# EAGLE design failoverBoard (EAGLE 7.7.0)
Failover Board: Allows an RC controller (like a DragonLink) to manually take over up to 7 PWM connections.

## Sheet 1 of 2
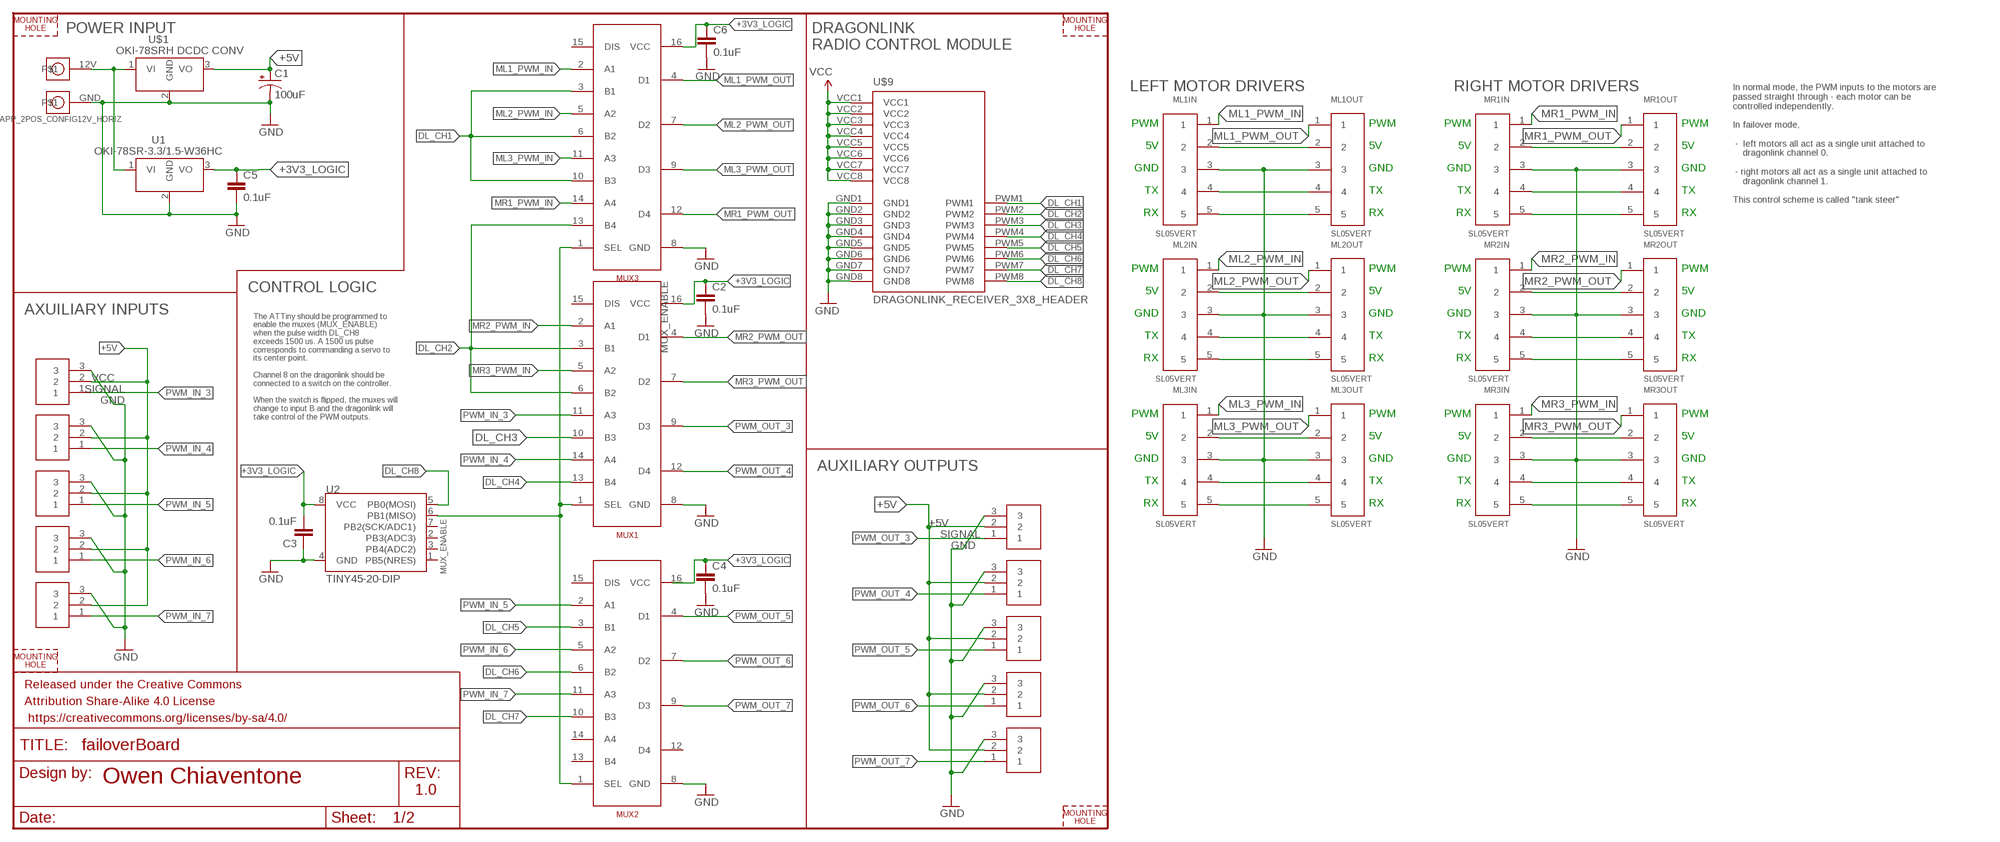
[diagram p0: schematic, sheet 1]

### Parts
C1  100uF  C_UHE1H121MPD1TD  [C_3.5MM]
C2  0.1uF  BOOST_CMP_CAP0603-CAP  [BOOST_CMP_0603-CAP]
C3  0.1uF  BOOST_CMP_CAP0603-CAP  [BOOST_CMP_0603-CAP]
C4  0.1uF  BOOST_CMP_CAP0603-CAP  [BOOST_CMP_0603-CAP]
C5  0.1uF  CAP0603-CAP  [0603-CAP]
C6  0.1uF  BOOST_CMP_CAP0603-CAP  [BOOST_CMP_0603-CAP]
FRAME1  FRAME-LETTER  [CREATIVE_COMMONS]
IN3  SIERRAALTO.CONN.SUPPLEMENT_CONN_3MOLEX_0705550037  [SIERRAALTO.CONN.SUPPLEMENT_MOLEX_0705550037_3]
IN4  SIERRAALTO.CONN.SUPPLEMENT_CONN_3MOLEX_0705550037  [SIERRAALTO.CONN.SUPPLEMENT_MOLEX_0705550037_3]
IN5  SIERRAALTO.CONN.SUPPLEMENT_CONN_3MOLEX_0705550037  [SIERRAALTO.CONN.SUPPLEMENT_MOLEX_0705550037_3]
IN6  SIERRAALTO.CONN.SUPPLEMENT_CONN_3MOLEX_0705550037  [SIERRAALTO.CONN.SUPPLEMENT_MOLEX_0705550037_3]
IN7  SIERRAALTO.CONN.SUPPLEMENT_CONN_3MOLEX_0705550037  [SIERRAALTO.CONN.SUPPLEMENT_MOLEX_0705550037_3]
J1  APP_2POS_CONFIG12V_HORIZ  [APP45_12V_HORIZ_CONFIG]
ML1IN  SL05VERT  [MOLEX-70543-0004]
ML1OUT  SL05VERT  [MOLEX-70543-0004]
ML2IN  SL05VERT  [MOLEX-70543-0004]
ML2OUT  SL05VERT  [MOLEX-70543-0004]
ML3IN  SL05VERT  [MOLEX-70543-0004]
ML3OUT  SL05VERT  [MOLEX-70543-0004]
MR1IN  SL05VERT  [MOLEX-70543-0004]
MR1OUT  SL05VERT  [MOLEX-70543-0004]
MR2IN  SL05VERT  [MOLEX-70543-0004]
MR2OUT  SL05VERT  [MOLEX-70543-0004]
MR3IN  SL05VERT  [MOLEX-70543-0004]
MR3OUT  SL05VERT  [MOLEX-70543-0004]
MUX1  CD40257  [SOIC16]
MUX2  CD40257  [SOIC16]
MUX3  CD40257  [SOIC16]
OUT3  SIERRAALTO.CONN.SUPPLEMENT_CONN_3MOLEX_0705550037  [SIERRAALTO.CONN.SUPPLEMENT_MOLEX_0705550037_3]
OUT4  SIERRAALTO.CONN.SUPPLEMENT_CONN_3MOLEX_0705550037  [SIERRAALTO.CONN.SUPPLEMENT_MOLEX_0705550037_3]
OUT5  SIERRAALTO.CONN.SUPPLEMENT_CONN_3MOLEX_0705550037  [SIERRAALTO.CONN.SUPPLEMENT_MOLEX_0705550037_3]
OUT6  SIERRAALTO.CONN.SUPPLEMENT_CONN_3MOLEX_0705550037  [SIERRAALTO.CONN.SUPPLEMENT_MOLEX_0705550037_3]
OUT7  SIERRAALTO.CONN.SUPPLEMENT_CONN_3MOLEX_0705550037  [SIERRAALTO.CONN.SUPPLEMENT_MOLEX_0705550037_3]
U1  OKI-78SR-3.3/1.5-W36HC  [OKI-78SR_HORIZ]
U2  TINY45-20-DIP  ATTINY45TINY45-20-DIP  [DIP08]
U$1  Q_OKI-78SR  [OKI-78SR_HORIZ]
U$3  MOUNTING_HOLE#6  [#6_SCREW]
U$4  MOUNTING_HOLE#6  [#6_SCREW]
U$5  MOUNTING_HOLE#6  [#6_SCREW]
U$6  MOUNTING_HOLE#6  [#6_SCREW]
U$9  DRAGONLINK_RECEIVER_3X8_HEADER  [3X8_HEADER_2.54MM]

### Nets
+3V3_LOGIC: C2.1 C3.2 C4.1 C5.1 C6.1 MUX1.16(VCC) MUX2.16(VCC) MUX3.16(VCC) U1.3(VO) U2.8(VCC)
+5V: C1.+ IN3.2 IN4.2 IN5.2 IN6.2 IN7.2 OUT3.2 OUT4.2 OUT5.2 OUT6.2 OUT7.2 U$1.3(VO)
DL_CH1: MUX3.3(B1) MUX3.6(B2) MUX3.10(B3) U$9.PWM1
DL_CH2: MUX1.3(B1) MUX1.6(B2) MUX3.13(B4) U$9.PWM2
DL_CH3: MUX1.10(B3) U$9.PWM3
DL_CH4: MUX1.13(B4) U$9.PWM4
DL_CH5: MUX2.3(B1) U$9.PWM5
DL_CH6: MUX2.6(B2) U$9.PWM6
DL_CH7: MUX2.10(B3) U$9.PWM7
DL_CH8: U2.5(PB0(MOSI)) U$9.PWM8
GND: C1.- C2.2 C3.1 C4.2 C5.2 C6.2 IN3.3 IN4.3 IN5.3 IN6.3 IN7.3 J1.GND ML1IN.3 ML1OUT.3 ML2IN.3 ML2OUT.3 ML3IN.3 ML3OUT.3 MR1IN.3 MR1OUT.3 MR2IN.3 MR2OUT.3 MR3IN.3 MR3OUT.3 MUX1.8(GND) MUX2.8(GND) MUX3.8(GND) OUT3.3 OUT4.3 OUT5.3 OUT6.3 OUT7.3 U1.2(GND) U2.4(GND) U$1.2(GND) U$9.GND1 U$9.GND2 U$9.GND3 U$9.GND4 U$9.GND5 U$9.GND6 U$9.GND7 U$9.GND8
ML1_PWM_IN: ML1IN.1 MUX3.2(A1)
ML1_PWM_OUT: ML1OUT.1 MUX3.4(D1)
ML2_PWM_IN: ML2IN.1 MUX3.5(A2)
ML2_PWM_OUT: ML2OUT.1 MUX3.7(D2)
ML3_PWM_IN: ML3IN.1 MUX3.11(A3)
ML3_PWM_OUT: ML3OUT.1 MUX3.9(D3)
MR1_PWM_IN: MR1IN.1 MUX3.14(A4)
MR1_PWM_OUT: MR1OUT.1 MUX3.12(D4)
MR2_PWM_IN: MR2IN.1 MUX1.2(A1)
MR2_PWM_OUT: MR2OUT.1 MUX1.4(D1)
MR3_PWM_IN: MR3IN.1 MUX1.5(A2)
MR3_PWM_OUT: MR3OUT.1 MUX1.7(D2)
MUX_ENABLE: MUX1.1(SEL) MUX2.1(SEL) MUX3.1(SEL) U2.6(PB1(MISO))
N$1: J1.12V U1.1(VI) U$1.1(VI)
N$2: ML1IN.4 ML1OUT.4
N$3: ML2IN.4 ML2OUT.4
N$4: ML2IN.5 ML2OUT.5
N$5: ML1IN.5 ML1OUT.5
N$6: ML3IN.4 ML3OUT.4
N$7: ML3IN.5 ML3OUT.5
N$8: ML3IN.2 ML3OUT.2
N$9: ML2IN.2 ML2OUT.2
N$10: ML1IN.2 ML1OUT.2
N$11: MR1IN.2 MR1OUT.2
N$12: MR1IN.4 MR1OUT.4
N$13: MR1IN.5 MR1OUT.5
N$14: MR2IN.4 MR2OUT.4
N$15: MR2IN.5 MR2OUT.5
N$16: MR3IN.4 MR3OUT.4
N$17: MR3IN.5 MR3OUT.5
N$18: MR3IN.2 MR3OUT.2
N$19: MR2IN.2 MR2OUT.2
PWM_IN_3: IN3.1 MUX1.11(A3)
PWM_IN_4: IN4.1 MUX1.14(A4)
PWM_IN_5: IN5.1 MUX2.2(A1)
PWM_IN_6: IN6.1 MUX2.5(A2)
PWM_IN_7: IN7.1 MUX2.11(A3)
PWM_OUT_3: MUX1.9(D3) OUT3.1
PWM_OUT_4: MUX1.12(D4) OUT4.1
PWM_OUT_5: MUX2.4(D1) OUT5.1
PWM_OUT_6: MUX2.7(D2) OUT6.1
PWM_OUT_7: MUX2.9(D3) OUT7.1
VCC: U$9.VCC1 U$9.VCC2 U$9.VCC3 U$9.VCC4 U$9.VCC5 U$9.VCC6 U$9.VCC7 U$9.VCC8
Unconnected: MUX1.15(DIS) MUX2.12(D4) MUX2.13(B4) MUX2.14(A4) MUX2.15(DIS) MUX3.15(DIS) U2.1(PB5(NRES)) U2.2(PB3(ADC3)) U2.3(PB4(ADC2)) U2.7(PB2(SCK/ADC1))

### Notes on the sheet
- POWER INPUT
- DRAGONLINK 
  RADIO CONTROL MODULE
- LEFT MOTOR DRIVERS | RIGHT MOTOR DRIVERS
- PWM | PWM | PWM | PWM
- 5V | 5V | 5V | 5V
- GND | GND | GND | GND
- TX | TX | TX | TX
- In normal mode, the PWM inputs to the motors are
  passed straight through - each motor can be
  controlled independently.
  
  In failover mode,
  
   -  left motors all act as a single unit attached to
      dragonlink channel 0. 
  
   - right motors all act as a single unit attached to
      dragonlink channel 1.
  
  This control scheme is called "tank steer"
- RX | RX | RX | RX
- PWM | PWM | PWM | PWM
- CONTROL LOGIC | 5V | 5V | 5V | 5V
- AXUILIARY INPUTS | GND | GND | GND | GND
- TX | TX | TX | TX
- RX | RX | RX | RX
- VCC
- SIGNAL
- PWM | PWM | PWM | PWM
- The ATTiny should be programmed to
  enable the muxes (MUX_ENABLE)
  when the pulse width DL_CH8
  exceeds 1500 us. A 1500 us pulse
  corresponds to commanding a servo to 
  its center point. 
  
  Channel 8 on the dragonlink should be
  connected to a switch on the controller.
  
  When the switch is flipped, the muxes will 
  change to input B and the dragonlink will
  take control of the PWM outputs.
- 5V | 5V | 5V | 5V
- GND | GND | GND | GND
- AUXILIARY OUTPUTS
- TX | TX | TX | TX
- RX | RX | RX | RX
- SIGNAL
- Owen Chiaventone
- 1.0

## Sheet 2 of 2

## Library data of the parts
C1 = MRDT-2014-All:C_UHE1H121MPD1TD: CAPACITOR ALUM ELEC, 120UF, 50V, 20%, RADIAL
C2-C4 C6 = Rover_MC2:BOOST_CMP_CAP: Capacitor Standard 0603 ceramic capacitor, and 0.1" leaded capacitor.
C5 = SparkFun-Passives:CAP: Capacitor Standard 0603 ceramic capacitor, and 0.1" leaded capacitor.
FRAME1 = SparkFun-Aesthetics:FRAME-LETTER: Schematic Frame Standard 8.5x11 US Letter frame
IN3-IN7 OUT3-OUT7 = Rover_MC2:SIERRAALTO.CONN.SUPPLEMENT_CONN_3
J1 = MRDT-Connectors:APP_2POS_CONFIG; COLOR1: YELLOW; COLOR2: BLACK
ML1IN ML1OUT ML2IN ML2OUT ML3IN ML3OUT MR1IN MR1OUT MR2IN MR2OUT MR3IN MR3OUT = MRDT-Connectors:SL05
MUX1-MUX3 = ruark2:CD40257
U1 = MRDT-ICs:OKI-78SR-*/1.5-W36?C: 4.95W DC/DC Converter Manufacturer: Murata; VOUT: +3v3
U2 = SparkFun-DigitalIC:ATTINY45: Atmel 8-pin 2/4/8kB flash uC; PROD_ID: IC-09439
U$1 = MRDT-2015-PowerBoard:Q_OKI-78SR: 4.95W DC/DC Converter Manufacturer: Murata Part Number: OKI-78SR-5/1.5-W36H-C OKI-78SR-3.3/1.5-W36H-C
U$3-U$6 = MRDT-Hardware:MOUNTING_HOLE: Mounting hole for M6 bolt. Standard use mounting hole for: Tiva C Connected - M6 Anderson Powerpole Mounting Wing - M8 Most frame-mounted PCB's - M8
U$9 = dragonlink:DRAGONLINK_RECEIVER

## Board
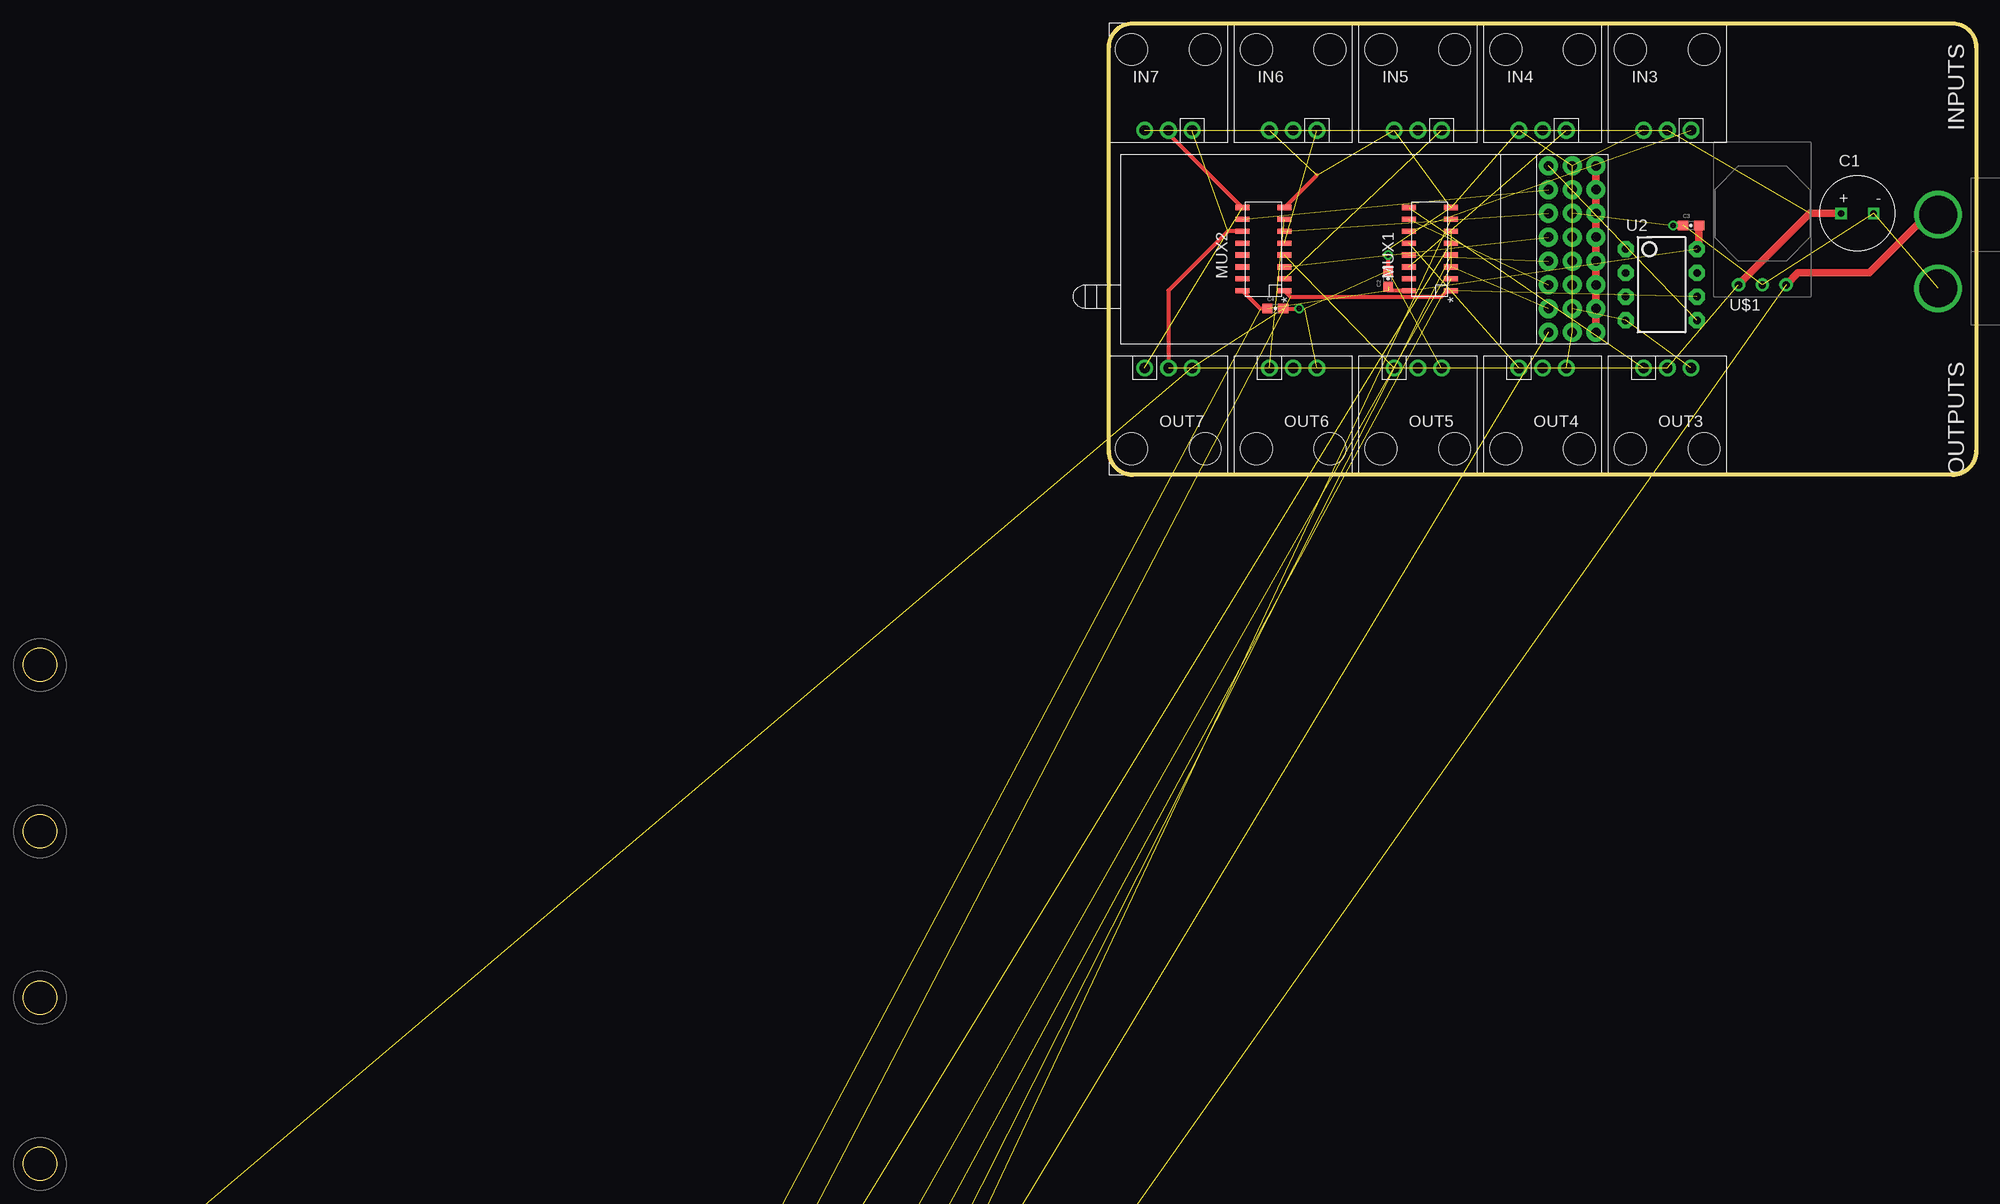
[diagram p1: board, top side]
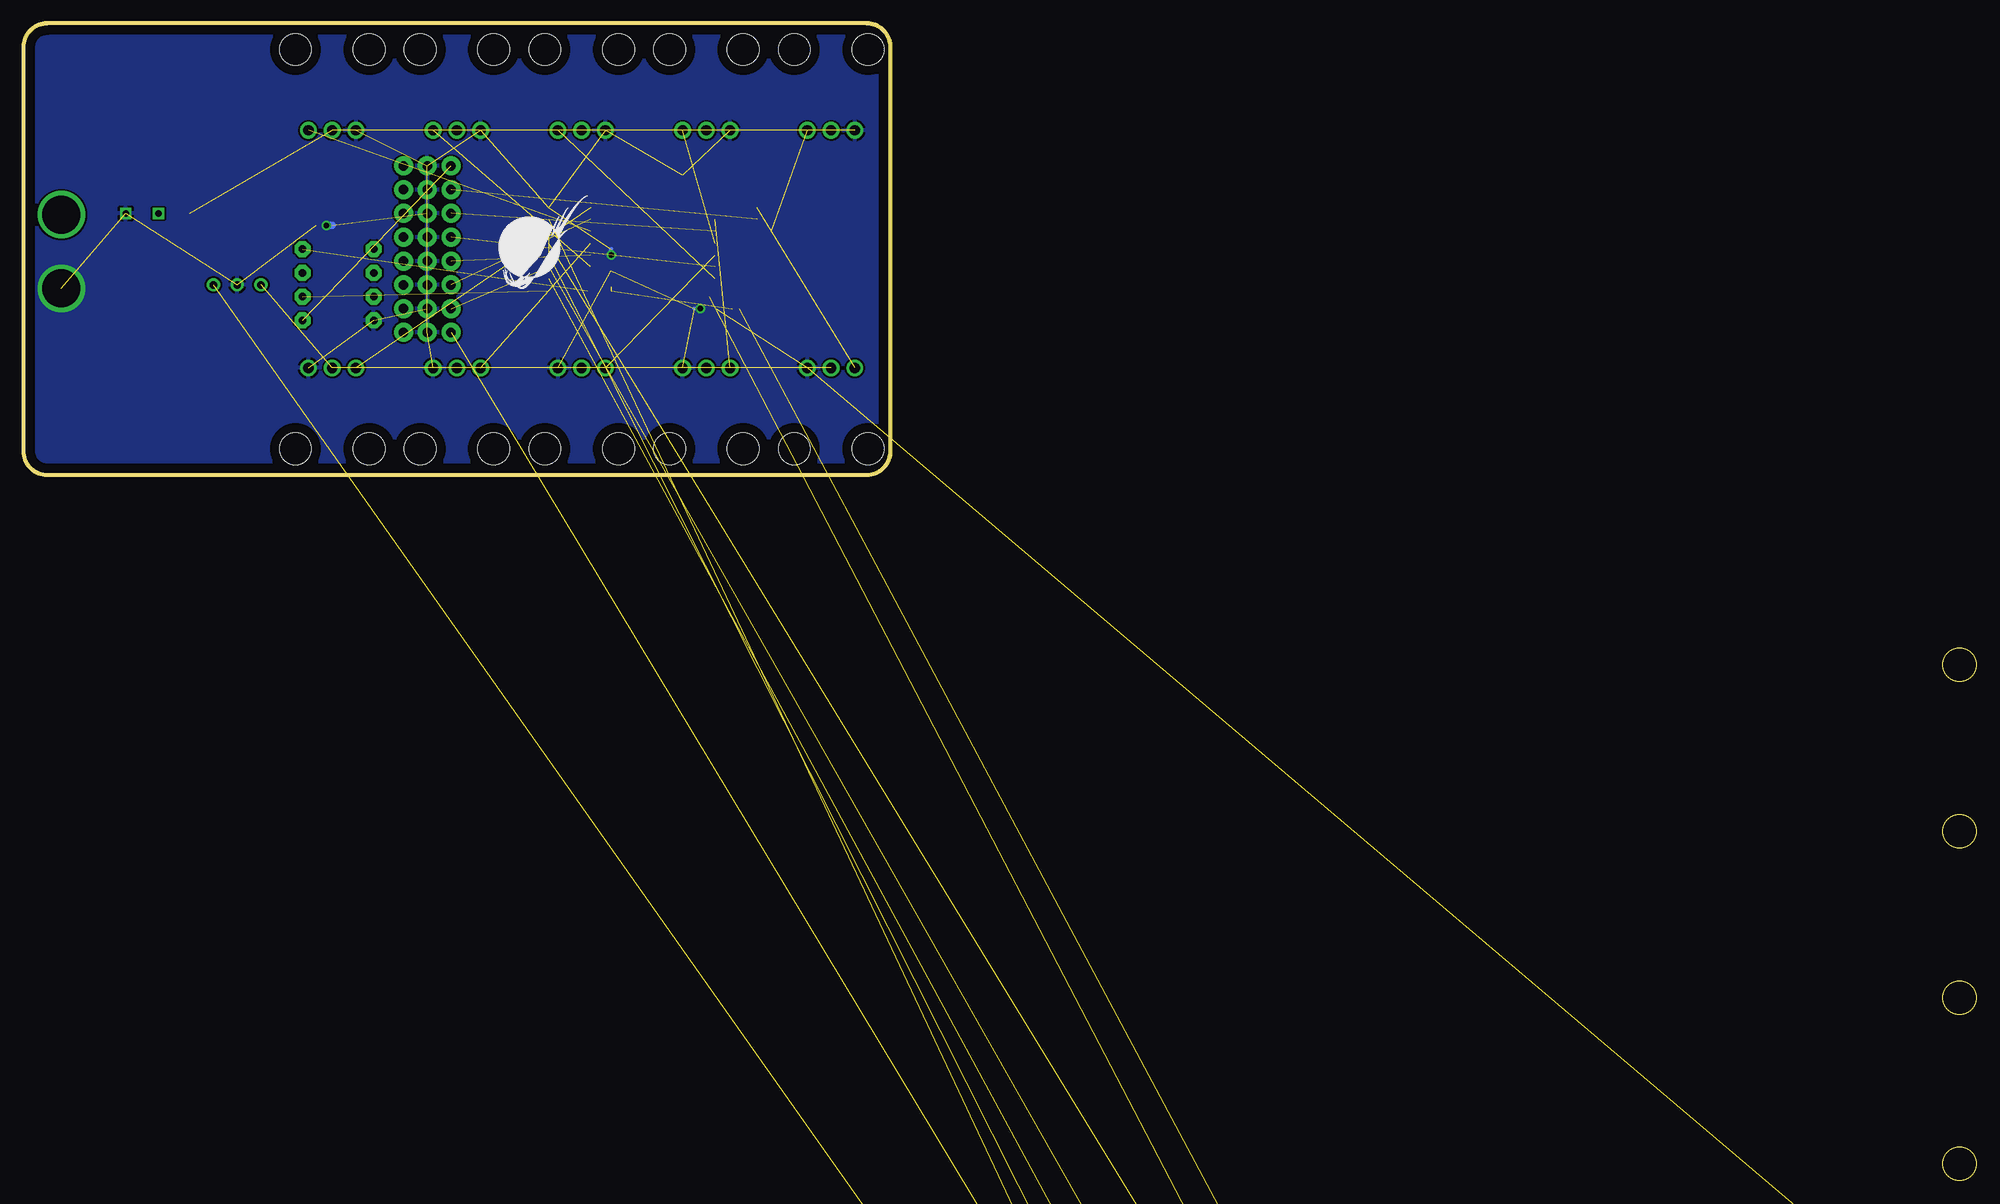
[diagram p2: board, bottom side, seen from below]

Size 92.71 x 48.26 mm. Coordinates in mm from the lower left corner, seen from the top.
Outline: 0,45.72 arc-90 2.54,48.26 90.17,48.26 arc-90 92.71,45.72 92.71,2.54 arc-90 90.17,0 2.54,0 arc-90 0,2.54 0,45.72
Copper layers (1*16): Top 0.035mm / dielectric 1.5mm / Bottom 0.035mm
Design rules "default": minimum track width 10mil, minimum drill 24mil, track to track 8mil, track to pad 8mil, pad to pad 8mil, via to via 8mil, smd to smd 8mil, copper to edge 40mil, drill to drill 8mil, minimum pad ring 10mil, minimum via ring 8mil, stop-mask expansion 4mil, vias tented up to drill 0mil, thermal gap 10mil

### Footprints (pad centres in the part's own frame; a part is rotated, then mirrored left to right if it is on the bottom)
C_3.5MM = drill 0.7 square: + -1.75,0; - 1.75,0
BOOST_CMP_0603-CAP = smd 1.1 x 1: 1 -0.85,0; 2 0.85,0
0603-CAP = smd 1.1 x 1: 1 -0.85,0; 2 0.85,0
SIERRAALTO.CONN.SUPPLEMENT_MOLEX_0705550037_3 = drill 1.092 pad 1.778: 1 2.54,0; 2 0,0; 3 -2.54,0 | hole 3.404: -3.937,8.636; 3.937,8.636
APP45_12V_HORIZ_CONFIG = drill 4.064: 12V 28.194,3.937; GND 28.194,11.811
MOLEX-70543-0004 = drill 1.1 square: 1 5.08,0 | drill 1.1: 2 2.54,0; 3 0,0; 4 -2.54,0; 5 -5.08,0
SOIC16 = smd 0.549 x 1.499: 1 -4.445,-2.25; 2 -3.175,-2.25; 3 -1.905,-2.25; 4 -0.635,-2.25; 5 0.635,-2.25; 6 1.905,-2.25; 7 3.175,-2.25; 8 4.445,-2.25; 9 4.445,2.25; 10 3.175,2.25; 11 1.905,2.25; 12 0.635,2.25; 13 -0.635,2.25; 14 -1.905,2.25; 15 -3.175,2.25; 16 -4.445,2.25
OKI-78SR_HORIZ = drill 0.9 pad 1.422: 1 0,0; 2 -2.54,0; 3 -5.08,0
DIP08 = drill 0.813 pad 1.727 octagon: 1 -3.81,-3.81; 2 -1.27,-3.81; 3 1.27,-3.81; 4 3.81,-3.81; 5 3.81,3.81; 6 1.27,3.81; 7 -1.27,3.81; 8 -3.81,3.81
OKI-78SR_HORIZ' = drill 0.8 pad 1.422: 1 0,0; 2 -2.54,0; 3 -5.08,0
3X8_HEADER_2.54MM = drill 1.016 pad 2.032: GND1 2.54,17.78; GND2 2.54,15.24; GND3 2.54,12.7; GND4 2.54,10.16; GND5 2.54,7.62; GND6 2.54,5.08; GND7 2.54,2.54; GND8 2.54,0; PWM1 5.08,17.78; PWM2 5.08,15.24; PWM3 5.08,12.7; PWM4 5.08,10.16; PWM5 5.08,7.62; PWM6 5.08,5.08; PWM7 5.08,2.54; PWM8 5.08,0; VCC1 0,17.78; VCC2 0,15.24; VCC3 0,12.7; VCC4 0,10.16; VCC5 0,7.62; VCC6 0,5.08; VCC7 0,2.54; VCC8 0,0

### Placement (x,y rotation side)
C1  80.01,27.94 0 top
C2  29.84,20.95 90 top
C3  62.23,26.67 0 top
C4  17.78,17.78 0 top
C5  -140.97,-279.4 0 top  (outside the outline)
C6  -140.97,-294.64 0 top  (outside the outline)
FRAME1  -101.6,156.21 0 top  (outside the outline)
IN3  59.69,36.83 0 top
IN4  46.35,36.83 0 top
IN5  33.02,36.83 0 top
IN6  19.68,36.83 0 top
IN7  6.35,36.83 0 top
J1  116.84,31.75 180 top
ML1IN  -107.95,-87.63 0 top  (outside the outline)
ML1OUT  -107.95,-137.16 0 top  (outside the outline)
ML2IN  -107.95,-104.14 0 top  (outside the outline)
ML2OUT  -107.95,-153.67 0 top  (outside the outline)
ML3IN  -107.95,-120.65 0 top  (outside the outline)
ML3OUT  -107.95,-170.18 0 top  (outside the outline)
MR1IN  -107.95,-186.69 0 top  (outside the outline)
MR1OUT  -107.95,-219.71 0 top  (outside the outline)
MR2IN  -107.95,-236.22 0 top  (outside the outline)
MR2OUT  -107.95,-252.73 0 top  (outside the outline)
MR3IN  -107.95,-203.2 0 top  (outside the outline)
MR3OUT  -107.95,-269.24 0 top  (outside the outline)
MUX1  34.29,24.13 90 top
MUX2  16.51,24.13 90 top
MUX3  -137.16,-287.02 0 top  (outside the outline)
OUT3  59.69,11.43 180 top
OUT4  46.35,11.43 180 top
OUT5  33.02,11.43 180 top
OUT6  19.68,11.43 180 top
OUT7  6.35,11.43 180 top
U1  -132.08,-269.24 0 top  (outside the outline)
U2  59.05,20.32 270 top
U$1  Q_OKI-78SR  [OKI-78SR_HORIZ']  72.39,20.32 0 top
U$2  [MRDT_LOGO]  41.91,19.05 0 bottom
U$3  -114.3,-20.32 0 top  (outside the outline)
U$4  -114.3,-38.1 0 top  (outside the outline)
U$5  -114.3,-55.88 0 top  (outside the outline)
U$6  -114.3,-73.66 0 top  (outside the outline)
U$9  52.07,33.02 180 top

### Tracks (layer width: path | path; a pad name or v marks a point on that pad's centre or on a via)
+3V3_LOGIC  (7 unrouted)
  Top 0.406: 32.38,19.68 MUX1.16 29.84,19.68 | C4.1 16.16,17.78 MUX2.16
  Top 0.813: U2.8 63.08,24.34 C3.2
+5V  (10 unrouted)
  Top 0.813: U$1.3 74.93,27.94 C1.+
DL_CH1  (3 unrouted)
DL_CH2  (3 unrouted)
DL_CH3  (1 unrouted)
DL_CH4  (1 unrouted)
DL_CH5  (1 unrouted)
DL_CH6  (1 unrouted)
DL_CH7  (1 unrouted)
DL_CH8  (1 unrouted)
GND  (via drill 0.6)  (42 unrouted)
  Top 0.406: MUX2.8 22.23,32.04 | C4.2 v20.32,17.78 | C2.2 v29.84,23.5
  Top 0.813: C3.1 v60.33,26.67
  Bottom 0.406: v20.32,17.78 20.95,17.78 | v29.84,23.5 29.84,24.13
  Bottom 0.813: v60.33,26.67 59.69,26.67
  pour Bottom: 0,48.26 92.71,48.26 92.71,0 0,0
ML1_PWM_IN  (1 unrouted)
ML1_PWM_OUT  (1 unrouted)
ML2_PWM_IN  (1 unrouted)
ML2_PWM_OUT  (1 unrouted)
ML3_PWM_IN  (1 unrouted)
ML3_PWM_OUT  (1 unrouted)
MR1_PWM_IN  (1 unrouted)
MR1_PWM_OUT  (1 unrouted)
MR2_PWM_IN  (1 unrouted)
MR2_PWM_OUT  (1 unrouted)
MR3_PWM_IN  (1 unrouted)
MR3_PWM_OUT  (1 unrouted)
MUX_ENABLE  (2 unrouted)
  Top 0.406: MUX2.1 19.39,19.05 35.56,19.05 36.2,19.68 MUX1.1
N$1  (1 unrouted)
  Top 0.813: J1.12V 87.5,27.81 81.28,21.59 73.66,21.59 U$1.1
N$2  (1 unrouted)
N$3  (1 unrouted)
N$4  (1 unrouted)
N$5  (1 unrouted)
N$6  (1 unrouted)
N$7  (1 unrouted)
N$8  (1 unrouted)
N$9  (1 unrouted)
N$10  (1 unrouted)
N$11  (1 unrouted)
N$12  (1 unrouted)
N$13  (1 unrouted)
N$14  (1 unrouted)
N$15  (1 unrouted)
N$16  (1 unrouted)
N$17  (1 unrouted)
N$18  (1 unrouted)
N$19  (1 unrouted)
PWM_IN_3  (1 unrouted)
PWM_IN_4  (1 unrouted)
PWM_IN_5  (1 unrouted)
PWM_IN_6  (1 unrouted)
PWM_IN_7  (1 unrouted)
  Top 0.406: MUX2.11 12.7,26.04 6.35,19.68 6.35,11.43
PWM_OUT_3  (1 unrouted)
PWM_OUT_4  (1 unrouted)
PWM_OUT_5  (1 unrouted)
PWM_OUT_6  (1 unrouted)
PWM_OUT_7  (1 unrouted)
  Top 0.406: MUX2.9 6.35,36.48 6.35,36.83
VCC
  Top 0.813: U$9.VCC8 U$9.VCC7 U$9.VCC6 U$9.VCC5 U$9.VCC4 U$9.VCC3 U$9.VCC2 U$9.VCC1

### Text on the board
_tsilk: INPUTS | OUTPUTS